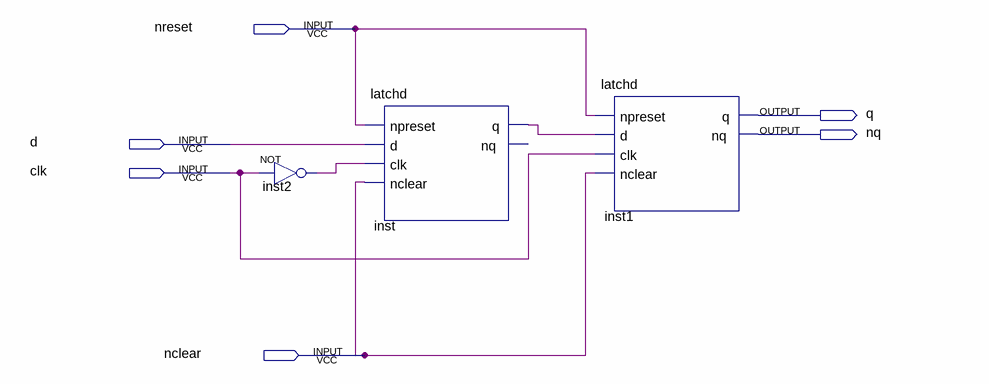
[diagram p0: schematic sheet]
// Quartus schematic flipflopd.bdf as structural Verilog: 3 symbols, 6 pins
module flipflopd (
  input  nreset,
  input  d,
  input  clk,
  input  nclear,
  output q,
  output nq
);

  wire inst2_out, inst_q;

  not inst2 (inst2_out, clk);
  latchd inst (.npreset(nreset), .d(d), .clk(inst2_out), .nclear(nclear), .q(inst_q));  // open: nq
  latchd inst1 (.npreset(nreset), .d(inst_q), .clk(clk), .nclear(nclear), .q(q), .nq(nq));
endmodule
